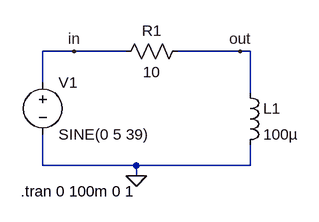
[diagram p0: schematic RL.asc]
RL.asc, the LTspice schematic file:
Version 4
SHEET 1 880 680
WIRE 80 64 32 64
WIRE 160 64 80 64
WIRE 336 64 240 64
WIRE 352 64 336 64
WIRE 32 112 32 64
WIRE 352 128 352 64
WIRE 32 240 32 192
WIRE 176 240 32 240
WIRE 352 240 352 208
WIRE 352 240 176 240
WIRE 176 256 176 240
FLAG 176 256 0
FLAG 336 64 out
FLAG 80 64 in
SYMBOL voltage 32 96 R0
WINDOW 123 0 0 Left 0
WINDOW 39 0 0 Left 0
SYMATTR InstName V1
SYMATTR Value SINE(0 5 39)
SYMBOL ind 336 112 R0
SYMATTR InstName L1
SYMATTR Value 100µ
SYMBOL res 256 48 R90
WINDOW 0 0 56 VBottom 2
WINDOW 3 32 56 VTop 2
SYMATTR InstName R1
SYMATTR Value 10
TEXT -2 280 Left 2 !.tran 0 100m 0 1

The netlist it stands for:
* RL.asc
V1 in 0 SINE(0 5 39)
L1 out 0 100µ
R1 out in 10
.tran 0 100m 0 1
.backanno
.end